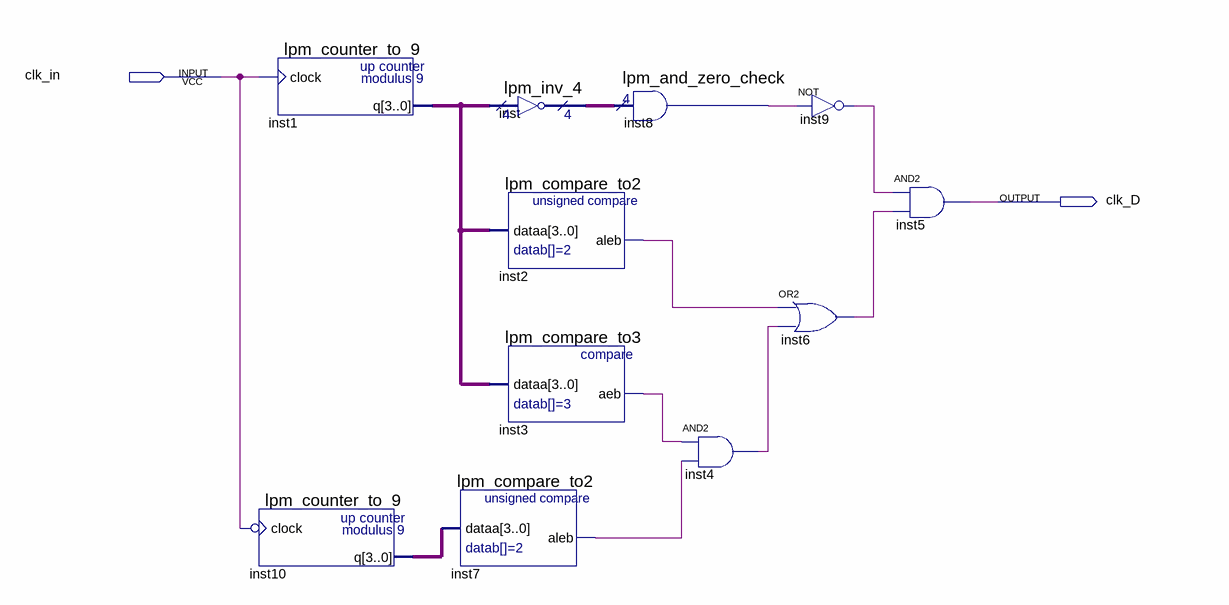
[diagram p0: schematic sheet]
// Quartus schematic Block2.bdf as structural Verilog: 11 symbols, 2 pins
module Block2 (
  input  clk_in,
  output clk_D
);

  wire inst2_aleb, inst3_aeb, inst4_out, inst6_out, inst7_aleb, inst8_result, inst9_out;
  wire [3:0] inst1_q, inst10_q, inst_result;

  lpm_counter_to_9 inst1 (.clock(clk_in), .q(inst1_q));
  lpm_counter_to_9 inst10 (.clock(~clk_in), .q(inst10_q));
  lpm_inv_4 inst (.data(inst1_q), .result(inst_result));
  lpm_compare_to2 inst2 (.dataa(inst1_q), .aleb(inst2_aleb));
  lpm_compare_to3 inst3 (.dataa(inst1_q), .aeb(inst3_aeb));
  lpm_compare_to2 inst7 (.dataa(inst10_q), .aleb(inst7_aleb));
  lpm_and_zero_check inst8 (.data(inst_result), .result(inst8_result));
  and inst4 (inst4_out, inst3_aeb, inst7_aleb);
  not inst9 (inst9_out, inst8_result);
  or inst6 (inst6_out, inst2_aleb, inst4_out);
  and inst5 (clk_D, inst9_out, inst6_out);
endmodule
